# EAGLE design led-bike-suit-controller_v2 (EAGLE 9.6.2)
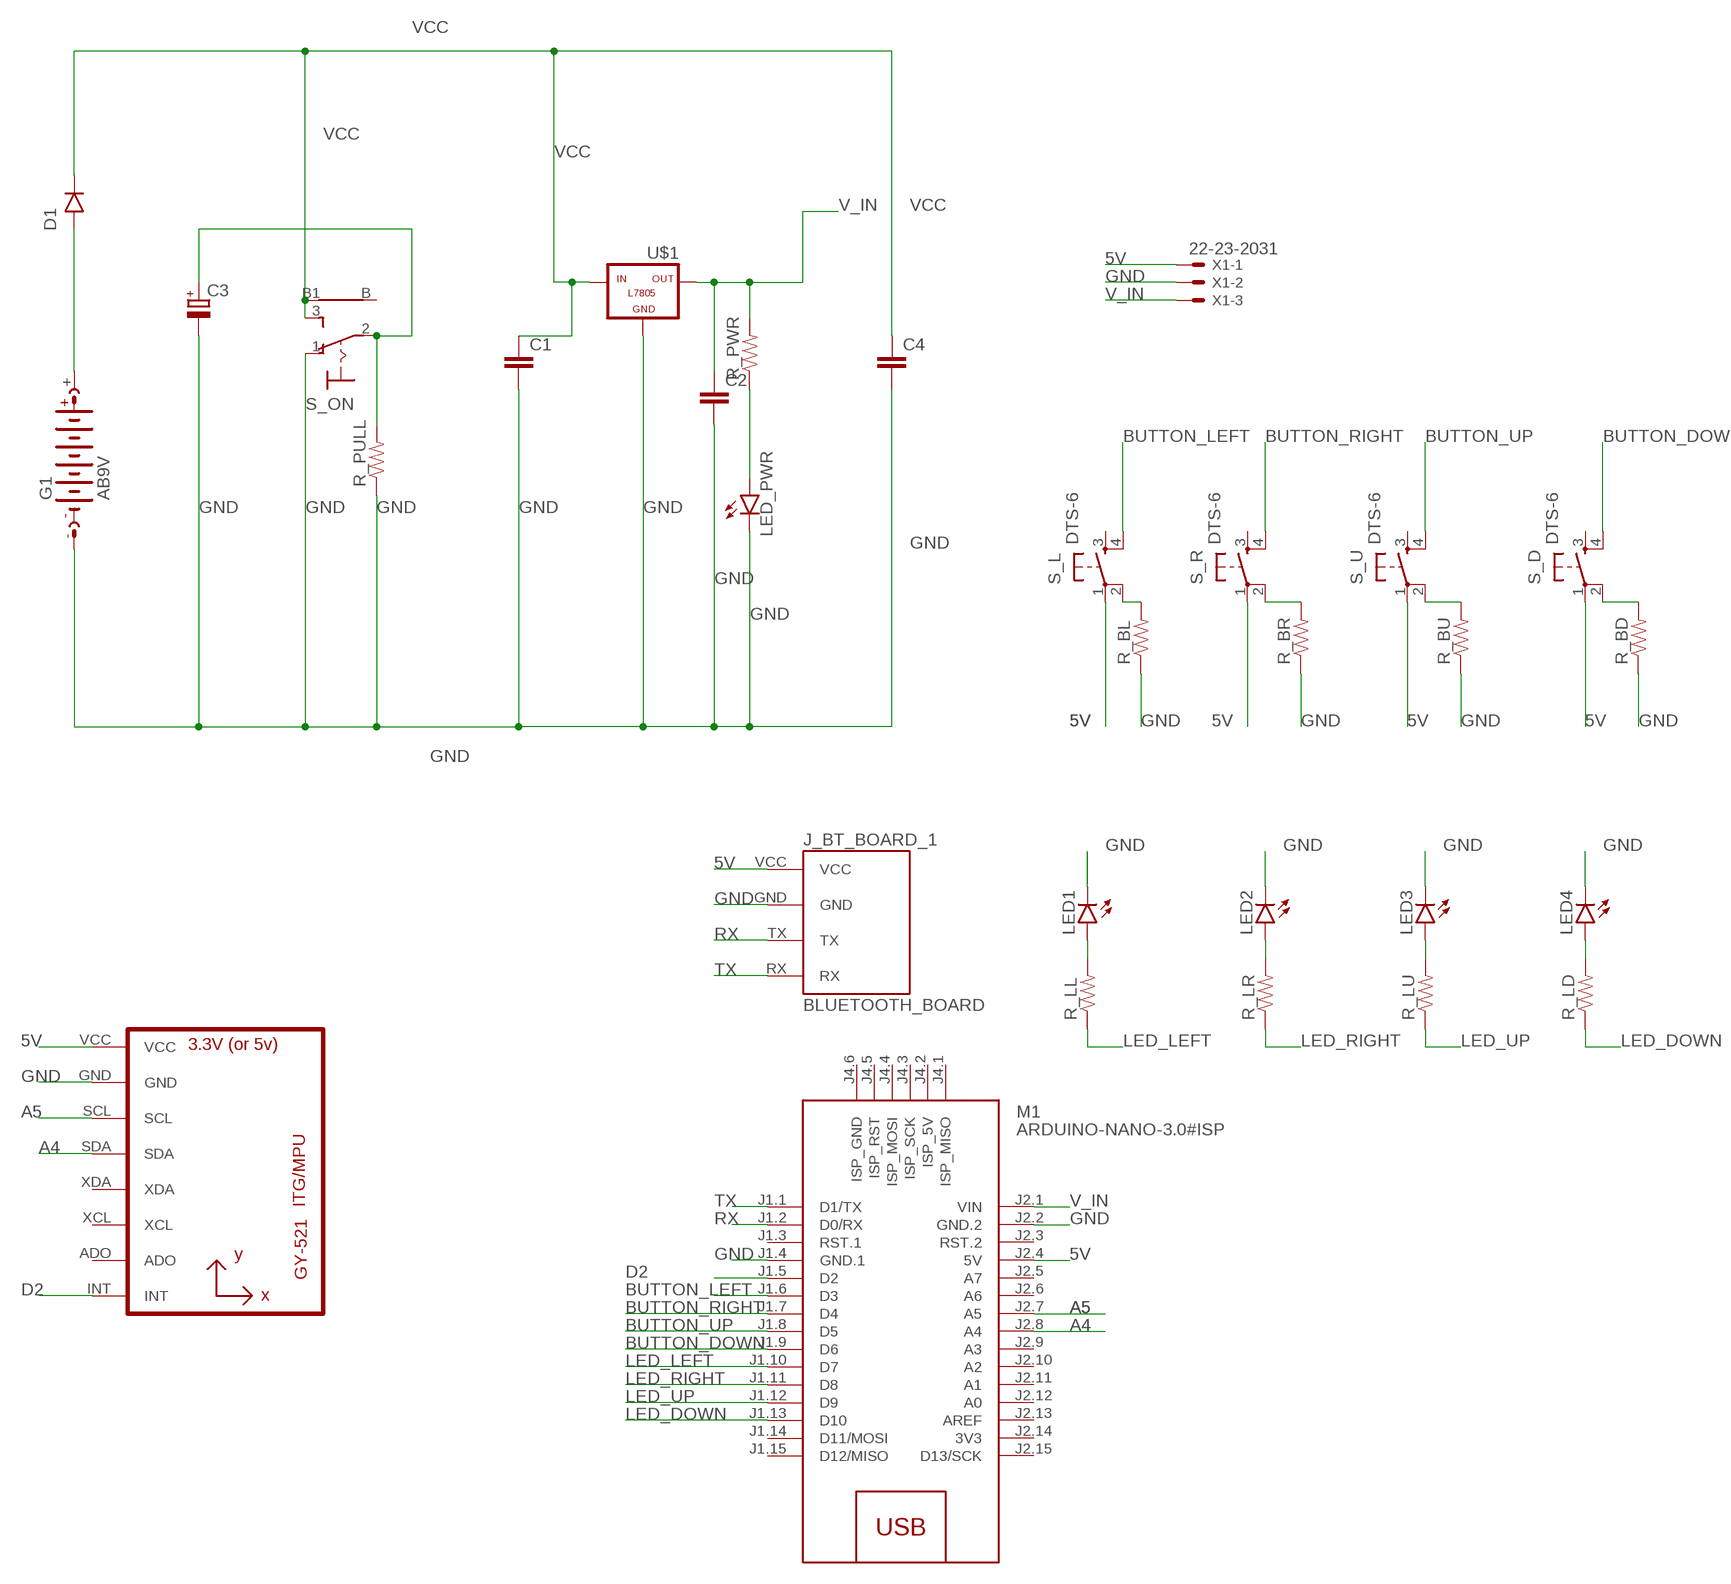
[diagram p0: schematic, sheet 1]

## Parts
C1  C2.5/4  [C2.5-4]
C2  C2.5/4  [C2.5-4]
C3  RCL_CPOL-EUE3.5-8  [ELECTROLYTIC_CAP_RCL_E3,5-8]
C4  C2.5/4  [C2.5-4]
D1  1N4001  [DO41-10]
G1  AB9V  [AB9V]
J_BT_BOARD_1  BLUETOOTH_BOARD  [BT_BOARD_FOOTPRINT]
LED1  LED5MM  [SPARKFUN-LED_LED5MM]
LED2  LED5MM  [SPARKFUN-LED_LED5MM]
LED3  LED5MM  [SPARKFUN-LED_LED5MM]
LED4  LED5MM  [SPARKFUN-LED_LED5MM]
LED_PWR  LED5MM  [LED5MM]
M1  ARDUINO-NANO-3.0#ISP  [ARDUINO-NANO-3.0#ISP]
R_BD  PASSIVES_RESISTORPTH-1/4W  [SPARKFUN-PASSIVES_AXIAL-0.4]
R_BL  PASSIVES_RESISTORPTH-1/4W  [SPARKFUN-PASSIVES_AXIAL-0.4]
R_BR  PASSIVES_RESISTORPTH-1/4W  [SPARKFUN-PASSIVES_AXIAL-0.4]
R_BU  PASSIVES_RESISTORPTH-1/4W  [SPARKFUN-PASSIVES_AXIAL-0.4]
R_LD  PASSIVES_RESISTORPTH-1/4W  [SPARKFUN-PASSIVES_AXIAL-0.4]
R_LL  PASSIVES_RESISTORPTH-1/4W  [SPARKFUN-PASSIVES_AXIAL-0.4]
R_LR  PASSIVES_RESISTORPTH-1/4W  [SPARKFUN-PASSIVES_AXIAL-0.4]
R_LU  PASSIVES_RESISTORPTH-1/4W  [SPARKFUN-PASSIVES_AXIAL-0.4]
R_PULL  PASSIVES_RESISTORPTH-1/4W  [SPARKFUN-PASSIVES_AXIAL-0.4]
R_PWR  PASSIVES_RESISTORPTH-1/4W  [SPARKFUN-PASSIVES_AXIAL-0.4]
S_D  DTS-6  [DTS-6]
S_L  DTS-6  [DTS-6]
S_ON  9070-1W  [9070-1W]
S_R  DTS-6  [DTS-6]
S_U  DTS-6  [DTS-6]
U1  GY-521MPU6050  [GY-521]
U$1  -L7805  [L7805]
X1  22-23-2031  [22-23-2031]

## Nets
5V: J_BT_BOARD_1.VCC M1.J2.4(5V) S_D.1 S_L.1 S_R.1 S_U.1 U1.VCC X1.1
A4: M1.J2.8(A4) U1.SDA
A5: M1.J2.7(A5) U1.SCL
BUTTON_DOWN: M1.J1.9(D6) S_D.4
BUTTON_LEFT: M1.J1.6(D3) S_L.4
BUTTON_RIGHT: M1.J1.7(D4) S_R.4
BUTTON_UP: M1.J1.8(D5) S_U.4
D2: M1.J1.5(D2) U1.INT
GND: C1.2 C2.2 C3.- C4.2 G1.- J_BT_BOARD_1.GND LED1.K(C) LED2.K(C) LED3.K(C) LED4.K(C) LED_PWR.K(CATHODE) M1.J1.4(GND.1) M1.J2.2(GND.2) R_BD.P$1 R_BL.P$1 R_BR.P$1 R_BU.P$1 R_PULL.P$1 S_ON.1(O) U1.GND U$1.GND X1.2
LED_DOWN: M1.J1.13(D10) R_LD.P$1
LED_LEFT: M1.J1.10(D7) R_LL.P$1
LED_RIGHT: M1.J1.11(D8) R_LR.P$1
LED_UP: M1.J1.12(D9) R_LU.P$1
N$1: LED1.A R_LL.P$2
N$2: R_BU.P$2 S_U.2
N$4: R_BD.P$2 S_D.2
N$5: LED2.A R_LR.P$2
N$7: R_BL.P$2 S_L.2
N$8: R_BR.P$2 S_R.2
N$9: LED3.A R_LU.P$2
N$10: LED4.A R_LD.P$2
N$11: C3.+ R_PULL.P$2 S_ON.2(P)
N$14: D1.A(ANODE) G1.+
N$16: LED_PWR.A(ANODE) R_PWR.P$1
RX: J_BT_BOARD_1.TX M1.J1.2(D0/RX)
TX: J_BT_BOARD_1.RX M1.J1.1(D1/TX)
V_IN: C2.1 M1.J2.1(VIN) R_PWR.P$2 U$1.OUT X1.3
VCC: C1.1 C4.1 D1.C(CATHODE) S_ON.3(S) S_ON.B1 U$1.IN
Unconnected: M1.J1.3(RST.1) M1.J1.14(D11/MOSI) M1.J1.15(D12/MISO) M1.J2.3(RST.2) M1.J2.5(A7) M1.J2.6(A6) M1.J2.9(A3) M1.J2.10(A2) M1.J2.11(A1) M1.J2.12(A0) M1.J2.13(AREF) M1.J2.15(D13/SCK) M1.J4.1(ISP_MISO) M1.J4.2(ISP_5V) M1.J4.3(ISP_SCK) M1.J4.4(ISP_MOSI) M1.J4.5(ISP_RST) M1.J4.6(ISP_GND) S_D.3 S_L.3 S_ON.B S_R.3 S_U.3 U1.ADO U1.XCL U1.XDA

## Power pins joined to a net without a drawn wire
3V3: M1.J2.14(3V3)

## Library data of the parts
C1 C2 C4 = capacitor-wima:C: CAPACITOR naming: grid - package width
C3 = EL311:RCL_CPOL-EU: POLARIZED CAPACITOR, European symbol
D1 = tango:1N4001: DIODE general purpose rectifier, 1 A
G1 = battery:AB9V: 9-V BATTERY CLIP
J_BT_BOARD_1 = Bluetooth HC-05:BLUETOOTH_BOARD: Bluetooth Board V1.05
LED1-LED4 = EL311:LED: LEDs Standard schematic elements and footprints for 5mm, 3mm, 1206, and 0603 sized LEDs. 5mm - Spark Fun Electronics SKU : COM-00529 (and others)
LED_PWR = tango:LED: LED OSRAM: - CHIPLED LG R971, LG N971, LY N971, LG Q971, LY Q971, LO R971, LY R971 LH N974, LH R974 LS Q976, LO Q976, LY Q976 LO Q996 - Hyper CHIPLED LW Q18S LB Q993, LB Q99A, LB R99A - SideLED LS A670, LO A670, LY A670, LG A670, LP A670 LB A673, LV A673, LT A673, LW A673 LH A674 LY A675 LS A676, LA A676, LO A676, LY A676, LW A676 LS A679, LY A679, LG A679 - Hyper Micro SIDELED® LS Y876, LA Y876, LO Y876, LY Y876 LT Y87S - SmartLED LW L88C, LW L88S LB L89C, LB L89S, LG L890 LS L89K, LO L89K, LY L89K LS L896, LA L896, LO L896, LY L896 - TOPLED LS T670, LO T670, LY T670, LG T670, LP T670 LSG T670, LSP T670, LSY T670, LOP T670, LYG T670 LG T671, LOG T671, LSG T671 LB T673, LV T673, LT T673, LW T673 LH T674 LS T676, LA T676, LO T676, LY T676, LB T676, LH T676, LSB T676, LW T676 LB T67C, LV T67C, LT T67C, LS T67K, LO T67K, LY T67K, LW E67C LS E67B, LA E67B, LO E67B, LY E67B, LB E67C, LV E67C, LT E67C LW T67C LS T679, LY T679, LG T679 LS T770, LO T770, LY T770, LG T770, LP T770 LB T773, LV T773, LT T773, LW T773 LH T774 LS E675, LA E675, LY E675, LS T675 LS T776, LA T776, LO T776, LY T776, LB T776 LHGB T686 LT T68C, LB T68C - Hyper Mini TOPLED® LB M676 - Mini TOPLED Santana® LG M470 LS M47K, LO M47K, LY M47K Source: http://www.osram.convergy.de - LUMILED® LXK2-PW12-R00, LXK2-PW12-S00, LXK2-PW14-U00, LXK2-PW14-V00 LXK2-PM12-R00, LXK2-PM12-S00, LXK2-PM14-U00 LXK2-PE12-Q00, LXK2-PE12-R00, LXK2-PE12-S00, LXK2-PE14-T00, LXK2-PE14-U00 LXK2-PB12-K00, LXK2-PB12-L00, LXK2-PB12-M00, LXK2-PB14-N00, LXK2-PB14-P00, LXK2-PB14-Q00 LXK2-PR12-L00, LXK2-PR12-M00, LXK2-PR14-Q00, LXK2-PR14-R00 LXK2-PD12-Q00, LXK2-PD12-R00, LXK2-PD12-S00 LXK2-PH12-R00, LXK2-PH12-S00 LXK2-PL12-P00, LXK2-PL12-Q00, LXK2-PL12-R00 Source: www.luxeon.com
M1 = diy-modules:ARDUINO-NANO-3.0#ISP: Arduino Nano 3.0 (and compatible devices) with ISP pads More details available here: https://www.arduino.cc/en/Main/ArduinoBoardNano Click here to find device on ebay.com <http://www.ebay.com/sch/arduino+nano>
R_BD R_BL R_BR R_BU R_LD R_LL R_LR R_LU R_PULL R_PWR = EL311:PASSIVES_RESISTOR: Resistor Basic schematic elements and footprints for 0603, 1206, and PTH resistors.
S_D S_L S_R S_U = switch-tact:DTS-6
S_ON = switch:9070-1W: TOGGLE SWITCH Marquardt
U1 = gy-521:GY-521
U$1 = tango:-L7805
X1 = con-molex:22-23-2031: .100" (2.54mm) Center Header - 3 Pin; MF: MOLEX; MPN: 22-23-2031; OC_FARNELL: 1462950; OC_NEWARK: 30C0862

## Net classes
0 default: width 0.305 mm, drill 0.508 mm, clearance 0.076 mm

## Board
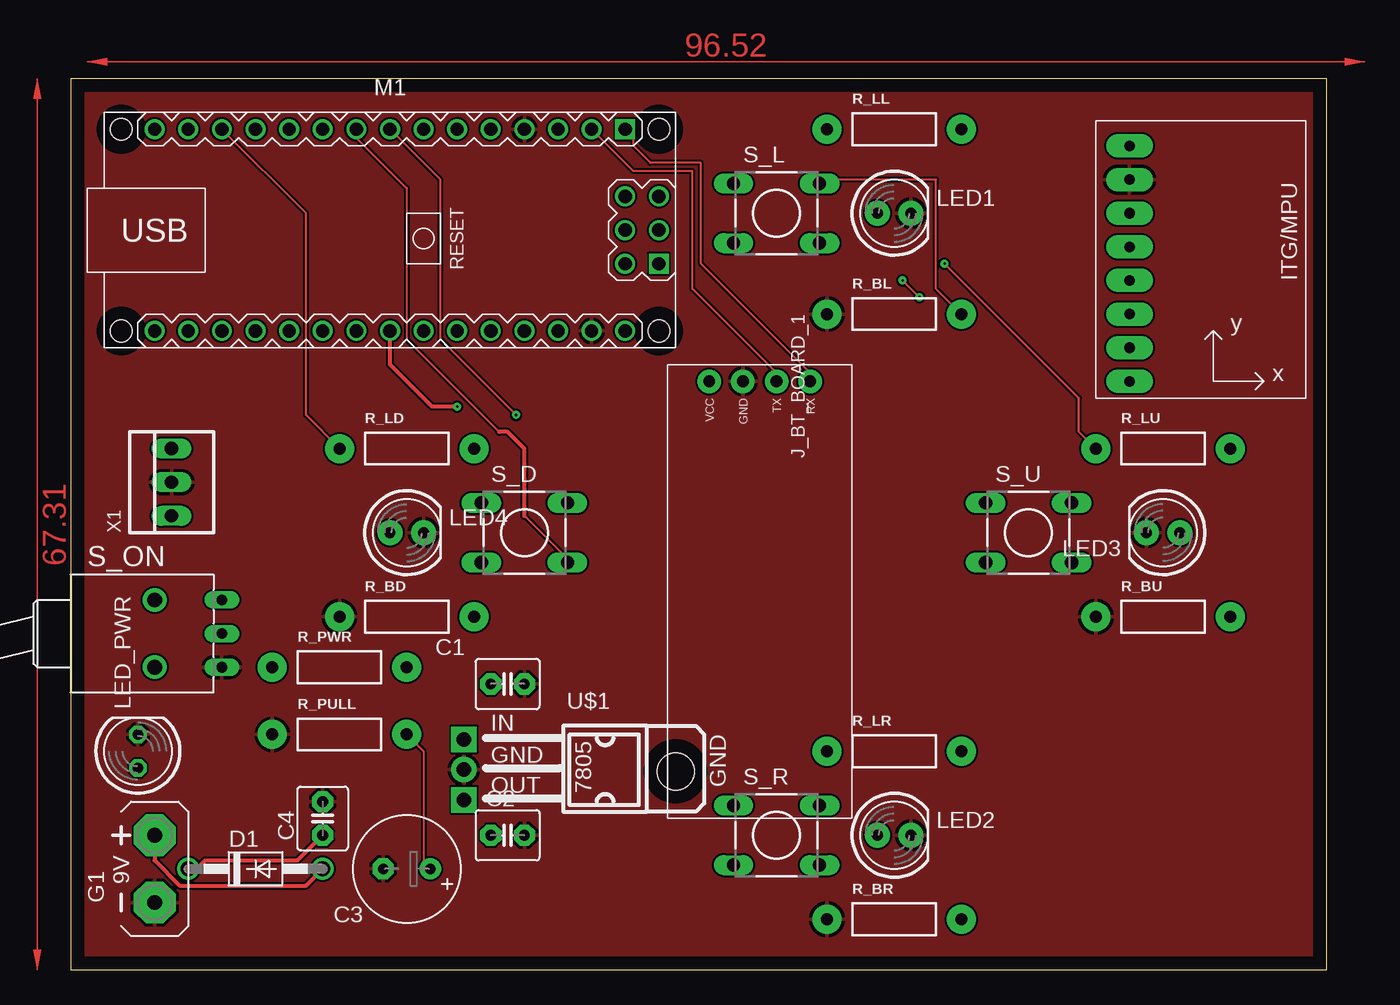
[diagram p1: board, top side]
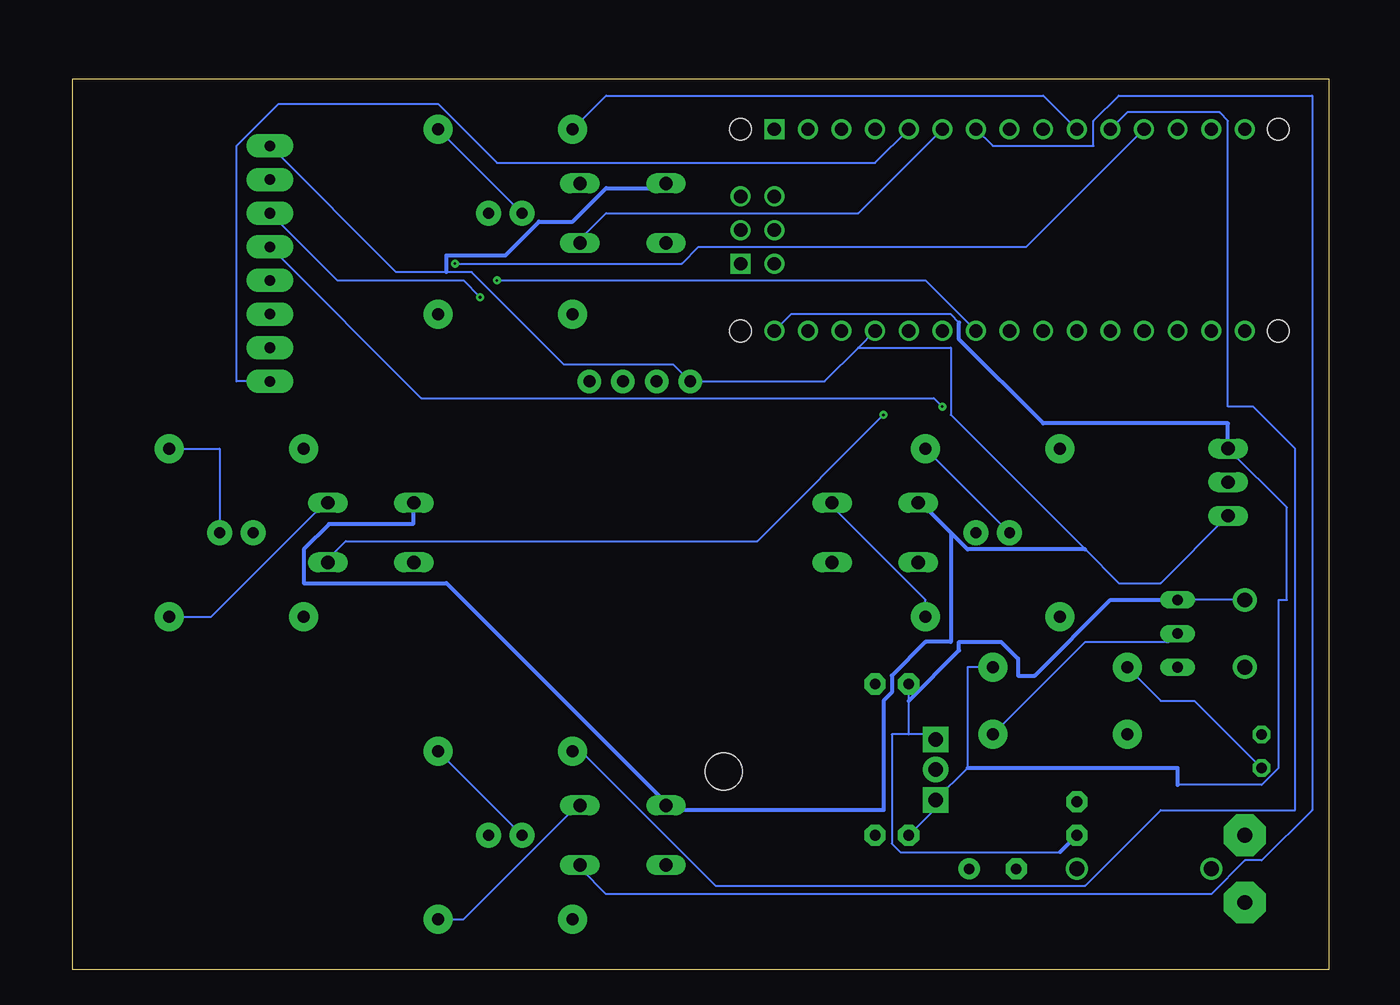
[diagram p2: board, bottom side, seen from below]

Size 94.92 x 67.3 mm. Coordinates in mm from the lower left corner, seen from the top.
Outline: 0,0 94.92,0 94.92,67.3 0,67.3 0,0
Copper layers (1*16): Top 0.035mm / dielectric 1.5mm / Bottom 0.035mm
Design rules "default *": minimum track width 6mil, minimum drill 0.2mm, track to track 6mil, track to pad 6mil, pad to pad 6mil, via to via 6mil, smd to smd 6mil, copper to edge 40mil, drill to drill 6mil, minimum pad ring 10mil, minimum via ring 8mil, stop-mask expansion 4mil, vias tented up to drill 0mil, thermal gap 10mil

### Footprints (pad centres in the part's own frame; a part is rotated, then mirrored left to right if it is on the bottom)
C2.5-4 = drill 0.813 pad 1.6 octagon: 1 -1.27,0; 2 1.27,0
ELECTROLYTIC_CAP_RCL_E3,5-8 = drill 0.813 pad 1.6: + -1.778,0 | drill 0.813 pad 1.6 octagon: - 1.778,0
DO41-10 = drill 1.118: A 5.08,0; C -5.08,0
AB9V = drill 1.118 pad 3.15 octagon: + 0,2.54; - 0,-2.54
BT_BOARD_FOOTPRINT = drill 0.9 pad 1.778: GND -16.51,-1.27; RX -16.51,3.81; TX -16.51,1.27; VCC -16.51,-3.81
SPARKFUN-LED_LED5MM = drill 0.813 pad 1.88: A -1.27,0; K 1.27,0
LED5MM = drill 0.813 octagon: A -1.27,0; K 1.27,0
ARDUINO-NANO-3.0#ISP = drill 1 square: J1.1 17.78,7.62; J4.1 20.32,-2.54 | drill 1: J1.2 15.24,7.62; J1.3 12.7,7.62; J1.4 10.16,7.62; J1.5 7.62,7.62; J1.6 5.08,7.62; J1.7 2.54,7.62; J1.8 0,7.62; J1.9 -2.54,7.62; J1.10 -5.08,7.62; J1.11 -7.62,7.62; J1.12 -10.16,7.62; J1.13 -12.7,7.62; J1.14 -15.24,7.62; J1.15 -17.78,7.62; J2.1 17.78,-7.62; J2.2 15.24,-7.62; J2.3 12.7,-7.62; J2.4 10.16,-7.62; J2.5 7.62,-7.62; J2.6 5.08,-7.62; J2.7 2.54,-7.62; J2.8 0,-7.62; J2.9 -2.54,-7.62; J2.10 -5.08,-7.62; J2.11 -7.62,-7.62; J2.12 -10.16,-7.62; J2.13 -12.7,-7.62; J2.14 -15.24,-7.62; J2.15 -17.78,-7.62; J4.2 17.78,-2.54; J4.3 20.32,0; J4.4 17.78,0; J4.5 20.32,2.54; J4.6 17.78,2.54 | hole 1.651: -20.32,7.62; -20.32,-7.62; 20.32,-7.62; 20.32,7.62
SPARKFUN-PASSIVES_AXIAL-0.4 = drill 0.9 pad 2.184: P$1 -5.08,0; P$2 5.08,0
DTS-6 = drill 1 long: 1 -3.25,2.25; 2 3.25,2.25; 3 -3.25,-2.25; 4 3.25,-2.25
9070-1W = drill 0.813 long: 1 5.08,-2.54; 2 5.08,0; 3 5.08,2.54 | drill 1.118 pad 1.778: B 0,-2.54; B1 0,2.54
GY-521 = drill 0.8 pad 1.778 long: ADO -8.89,-6.35; GND -8.89,6.35; INT -8.89,-8.89; SCL -8.89,3.81; SDA -8.89,1.27; VCC -8.89,8.89; XCL -8.89,-3.81; XDA -8.89,-1.27
L7805 = drill 1.1 pad 1.93: GND 0.127,-9.652 | drill 1.1 pad 1.93 square: IN -2.159,-9.652; OUT 2.413,-9.652 | hole 2.8: 0.254,6.35
22-23-2031 = drill 1 long: 1 -2.54,0; 2 0,0; 3 2.54,0

### Placement (x,y rotation side)
C1  33.02,21.59 0 top
C2  33.02,10.16 0 top
C3  25.4,7.62 180 top
C4  19.05,11.43 90 top
D1  13.97,7.62 0 top
G1  6.35,7.62 0 top
J_BT_BOARD_1  52.07,27.94 270 top
LED1  62.23,57.15 0 top
LED2  62.23,10.16 0 top
LED3  82.55,33.02 180 top
LED4  25.4,33.02 0 top
LED_PWR  5.08,16.51 90 top
M1  24.13,55.88 0 top
R_BD  25.4,26.67 0 top
R_BL  62.23,49.53 0 top
R_BR  62.23,3.81 0 top
R_BU  82.55,26.67 0 top
R_LD  25.4,39.37 0 top
R_LL  62.23,63.5 0 top
R_LR  62.23,16.51 0 top
R_LU  82.55,39.37 0 top
R_PULL  20.32,17.78 0 top
R_PWR  20.32,22.86 0 top
S_D  34.29,33.02 0 top
S_L  53.34,57.15 0 top
S_ON  6.35,25.4 0 top
S_R  53.34,10.16 0 top
S_U  72.39,33.02 0 top
U1  88.9,53.34 0 top
U$1  39.37,15.24 270 top
X1  7.62,36.83 90 top

### Tracks (layer width: path | path; a pad name or v marks a point on that pad's centre or on a via)
5V
  Bottom 0.152: X1.1 12.7,29.21 15.88,29.21 18.41,31.75 28.57,41.91 28.57,46.99 35.56,46.99 | 35.56,46.99 38.1,44.45 J_BT_BOARD_1.VCC 49.53,45.72 57.78,45.72 64.77,52.7 66.67,52.7 70.48,52.7 U1.VCC | 35.56,46.99 M1.J2.4
  Bottom 0.305: S_U.1 69.22,34.93 69.22,33.66 75.56,33.66 77.47,31.75 77.47,29.21 66.67,29.21 50.16,12.7 S_R.1 49.53,12.06 33.66,12.06 33.66,20.32 33.02,20.95 33.02,22.23 30.48,24.77 28.57,24.77 28.57,33.02 | 28.57,33.02 27.3,31.75 18.41,31.75 | 28.57,33.02 30.48,34.93 S_D.1 | 66.67,52.7 66.67,53.97 62.23,53.97 59.69,56.52 57.15,56.52 54.61,59.06 50.16,59.06 S_L.1
A4  (via drill 0.2)
  Top 0.305: v29.21,42.55 27.3,42.55 24.13,45.72 M1.J2.8
  Bottom 0.152: v29.21,42.55 29.84,43.18 68.58,43.18 U1.SDA
A5  (via drill 0.2)
  Top 0.152: v64.14,50.8 v62.87,52.07
  Bottom 0.152: M1.J2.7 30.48,52.07 v62.87,52.07 | v64.14,50.8 65.41,52.07 74.93,52.07 U1.SCL
BUTTON_DOWN
  Top 0.152: 34.29,34.29 37.47,31.12 S_D.4 | 32.38,40.64 25.4,47.62 25.4,59.06 21.59,62.86 M1.J1.9
  Top 0.305: 34.29,34.29 34.29,39.37 33.02,40.64 32.38,40.64
BUTTON_LEFT
  Bottom 0.152: M1.J1.6 35.56,57.15 54.61,57.15 56.52,55.25 S_L.4
BUTTON_RIGHT
  Bottom 0.152: M1.J1.7 25.4,62.23 17.78,62.23 17.78,64.14 15.88,66.04 1.27,66.04 1.27,12.06 5.08,8.26 6.35,8.26 8.89,5.71 54.61,5.71 56.52,7.62 S_R.4
BUTTON_UP  (via drill 0.2)
  Top 0.152: M1.J1.8 27.94,59.69 27.94,47.62 v33.66,41.91
  Bottom 0.152: v33.66,41.91 43.18,32.38 74.3,32.38 75.56,31.12 S_U.4
D2
  Bottom 0.152: M1.J1.5 34.29,60.96 62.87,60.96 67.31,65.41 79.38,65.41 82.55,62.23 82.55,44.45 U1.INT
GND
  pour Top: -1.27,68.58 -1.27,-1.27 96.52,-1.27 96.52,68.58
LED_DOWN
  Top 0.152: M1.J1.13 17.78,57.15 17.78,41.91 R_LD.P$1
LED_LEFT
  Bottom 0.152: M1.J1.10 21.59,66.04 54.61,66.04 R_LL.P$1
LED_RIGHT
  Bottom 0.152: M1.J1.11 15.24,64.77 8.26,64.77 7.62,64.14 7.62,42.55 5.71,42.55 2.54,39.37 2.54,12.06 12.7,12.06 18.41,6.35 46.35,6.35 56.52,16.51 R_LR.P$1
LED_UP  (via drill 0.2)
  Top 0.152: v66.04,53.34 76.2,43.18 76.2,40.64 R_LU.P$1
  Bottom 0.152: M1.J1.12 22.86,54.61 47.62,54.61 48.9,53.34 v66.04,53.34
N$1
  Bottom 0.152: R_LL.P$2 LED1.A
N$2
  Bottom 0.152: R_BU.P$2 84.45,26.67 76.2,34.93 S_U.2
N$4
  Bottom 0.152: R_BD.P$2 30.48,27.94 37.47,34.93 S_D.2
N$5
  Bottom 0.152: R_LR.P$2 LED2.A
N$7
  Top 0.152: R_BL.P$2 65.41,51.44 65.41,59.69 57.15,59.69 S_L.2
N$8
  Bottom 0.152: R_BR.P$2 65.41,3.81 57.15,12.06 S_R.2
N$9
  Bottom 0.152: LED3.A 83.82,39.37 R_LU.P$2
N$10
  Bottom 0.152: R_LD.P$2 LED4.A
N$11
  Top 0.152: R_PULL.P$2 26.67,16.51 26.67,7.62 C3.+
  Bottom 0.152: S_ON.2 12.06,24.77 18.41,24.77 R_PULL.P$2
N$14
  Top 0.305: D1.A 17.78,6.35 8.26,6.35 6.35,8.26 G1.+
N$16
  Bottom 0.152: LED_PWR.A 10.16,20.32 12.7,20.32 R_PWR.P$1
RX
  Top 0.152: M1.J1.2 42.55,60.33 46.99,60.33 46.99,51.44 53.34,45.09 J_BT_BOARD_1.TX
TX
  Top 0.152: M1.J1.1 42.55,62.86 42.55,62.23 43.81,60.96 47.62,60.96 47.62,53.34 55.88,45.09 J_BT_BOARD_1.RX
V_IN
  Bottom 0.152: X1.3 3.17,34.93 3.17,27.94 3.81,27.94 3.81,15.24 5.08,13.97 11.43,13.97 | M1.J2.1 40.64,49.53 28.57,49.53 27.94,48.9 | C2.1 29.21,12.7 U$1.OUT 27.3,15.24 27.3,22.86 R_PWR.P$2
  Bottom 0.305: 27.94,48.9 27.94,47.62 21.59,41.27 7.62,41.27 X1.3 | 27.3,15.24 11.43,15.24 11.43,13.97
VCC
  Top 0.305: C4.1 17.14,8.26 10.16,8.26 9.53,7.62 D1.C
  Bottom 0.152: 31.75,17.78 31.75,20.32 C1.1 | 31.75,17.78 29.84,17.78 U$1.IN | 20.32,8.89 32.38,8.89 33.02,9.53 33.02,17.78 31.75,17.78 | S_ON.B1 S_ON.3
  Bottom 0.305: 20.32,8.89 C4.1 | S_ON.3 16.51,27.94 22.23,22.23 23.5,22.23 23.5,23.5 24.77,24.77 27.94,24.77 27.94,24.13 31.75,20.32
(copper drawn outside any net)
  shapes: Top area x2